# EAGLE schematic SterownikCNC4 (EAGLE 7.5.0)
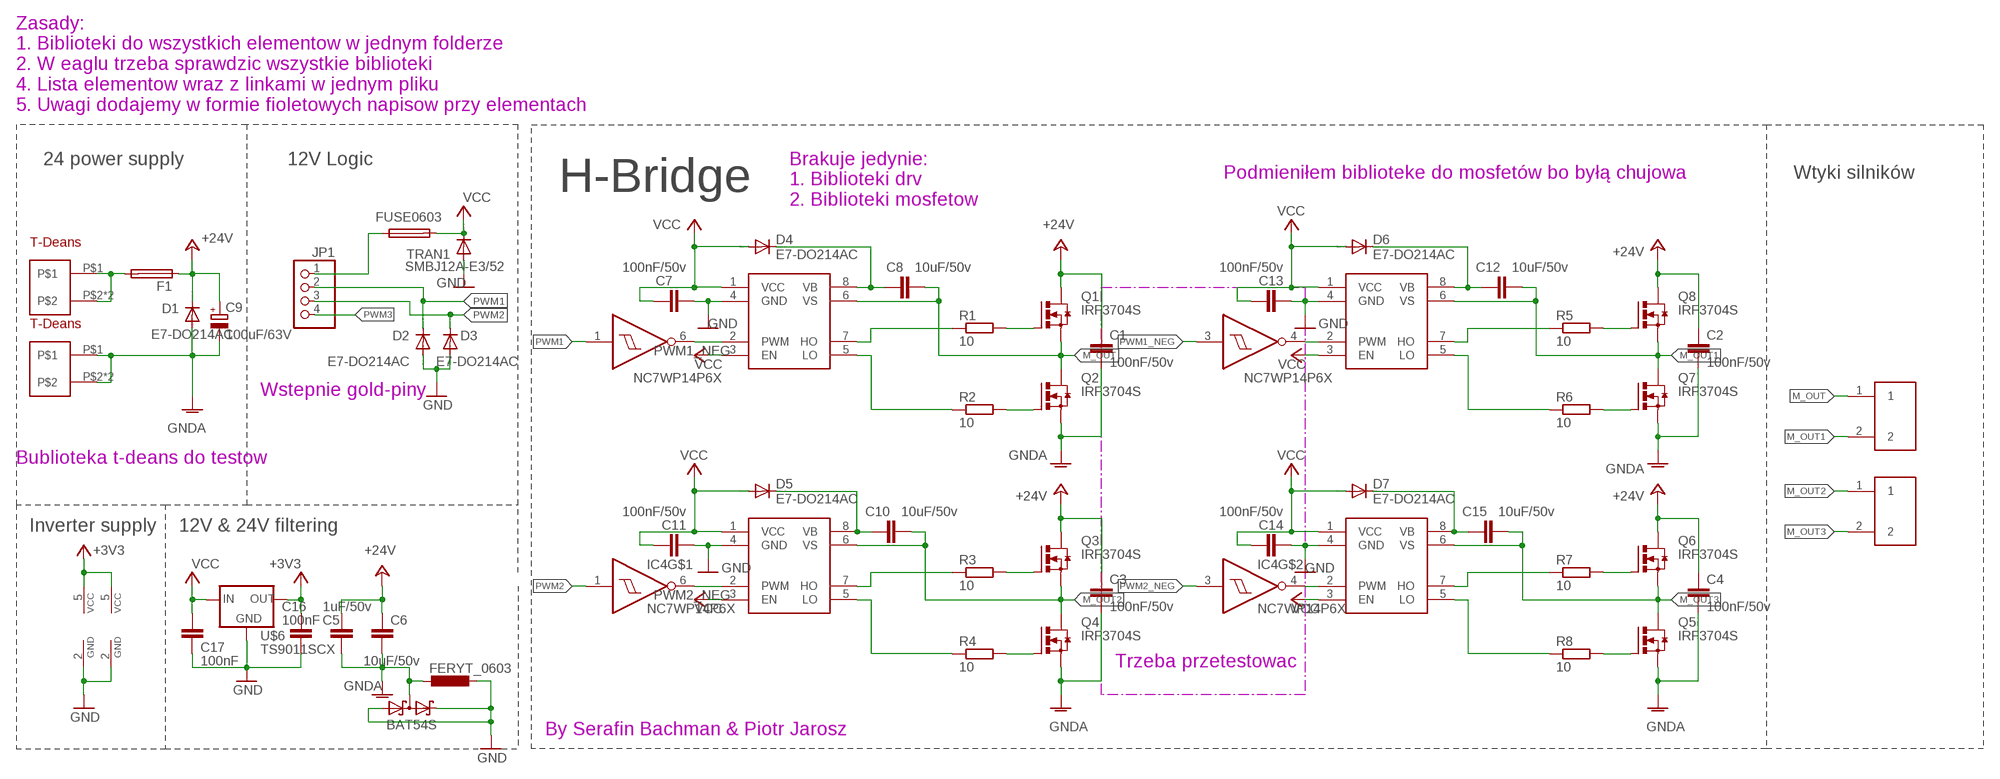
[diagram p0: schematic, sheet 1]

## Parts
C1  100nF/50v  C-EUC0603K  [C0603K]
C2  100nF/50v  C-EUC0603K  [C0603K]
C3  100nF/50v  C-EUC0603K  [C0603K]
C4  100nF/50v  C-EUC0603K  [C0603K]
C5  1uF/50v  C-EUC0603K  [C0603K]
C6  10uF/50v  C-EUC0603K  [C0603K]
C7  100nF/50v  C-EUC0603K  [C0603K]
C8  10uF/50v  C-EUC0603K  [C0603K]
C9  100uF/63V  CPOL-EUE5-10.5  [E5-10,5]
C10  10uF/50v  C-EUC0603K  [C0603K]
C11  100nF/50v  C-EUC0603K  [C0603K]
C12  10uF/50v  C-EUC0603K  [C0603K]
C13  100nF/50v  C-EUC0603K  [C0603K]
C14  100nF/50v  C-EUC0603K  [C0603K]
C15  10uF/50v  C-EUC0603K  [C0603K]
C16  100nF  C-EUC0603K  [C0603K]
C17  100nF  C-EUC0603K  [C0603K]
D1  E7-DO214AC  [DO214AC]
D2  E7-DO214AC  [DO214AC]
D3  E7-DO214AC  [DO214AC]
D4  E7-DO214AC  [DO214AC]
D5  E7-DO214AC  [DO214AC]
D6  E7-DO214AC  [DO214AC]
D7  E7-DO214AC  [DO214AC]
D8  BAT54S  [SOT23]
F1  TE5  [TE5]
IC1  NC7WP14P6X  [SOT65P210X110-6AN_SC88_SC70-6]
IC4  NC7WP14P6X  [SOT65P210X110-6AN_SC88_SC70-6]
JP1  PINHD-1X4  [1X04]
Q1  IRF3704S  [D2PACK]
Q2  IRF3704S  [D2PACK]
Q3  IRF3704S  [D2PACK]
Q4  IRF3704S  [D2PACK]
Q5  IRF3704S  [D2PACK]
Q6  IRF3704S  [D2PACK]
Q7  IRF3704S  [D2PACK]
Q8  IRF3704S  [D2PACK]
R1  10  R-EU_R0603  [R0603]
R2  10  R-EU_R0603  [R0603]
R3  10  R-EU_R0603  [R0603]
R4  10  R-EU_R0603  [R0603]
R5  10  R-EU_R0603  [R0603]
R6  10  R-EU_R0603  [R0603]
R7  10  R-EU_R0603  [R0603]
R8  10  R-EU_R0603  [R0603]
TRAN1  SMBJ12A-E3/52  [DO214AA]
U1  IR2104  [SO08]
U2  IR2104  [SO08]
U3  IR2104  [SO08]
U4  IR2104  [SO08]
U$2  T-DEANS  [T-DEANS]
U$3  FUSE0603  [0603]
U$4  FERYT_0603  [R0603]
U$5  T-DEANS  [T-DEANS]
U$6  TS9011SCX  [SOT23]
U$7  PTB-02_5.08MM  [PTB-5.08MM-02]
U$9  PTB-02_5.08MM  [PTB-5.08MM-02]

## Nets
+3V3: C16.1 IC1.5(VCC) IC4.5(VCC) U$6.2(OUT)
+12V: C7.1 C11.1 C13.1 C14.1 D4.A D5.A D6.A D7.A U1.1(VCC) U2.1(VCC) U3.1(VCC) U4.1(VCC) ; supply symbol labelled VCC
+24V: C1.1 C2.1 C3.1 C4.1 C5.1 C6.1 C9.+ D1.C F1.1 Q1.2(D) Q3.2(D) Q6.2(D) Q8.2(D)
F2: JP1.1 U$3.1
GND: C7.2 C11.2 C13.2 C14.2 C16.2 C17.2 D2.A D3.A D8.1(A1) D8.2(C2) IC1.2(GND) IC4.2(GND) TRAN1.A U1.4(GND) U2.4(GND) U3.4(GND) U4.4(GND) U$4.2 U$6.1(GND)
GNDA: C1.2 C2.2 C3.2 C4.2 C5.2 C6.2 C9.- D1.A D8.3(C1A2) Q2.3(S) Q4.3(S) Q5.3(S) Q7.3(S) U$4.1 U$5.P$1 U$5.P$2 U$5.P$3
M_OUT: C8.2 Q1.3(S) Q2.2(D) U1.6(VS) U$7.1
M_OUT1: C12.2 Q7.2(D) Q8.3(S) U2.6(VS) U$7.2
M_OUT2: C10.2 Q3.3(S) Q4.2(D) U3.6(VS) U$9.1
M_OUT3: C15.2 Q5.2(D) Q6.3(S) U4.6(VS) U$9.2
N$1: Q1.1(G) R1.2
N$2: Q2.1(G) R2.2
N$3: R1.1 U1.7(HO)
N$4: R2.1 U1.5(LO)
N$5: IC1.4(O) U2.2(PWM)
N$6: IC4.4(O) U4.2(PWM)
N$7: R5.1 U2.7(HO)
N$8: R6.1 U2.5(LO)
N$10: Q7.1(G) R6.2
N$11: Q8.1(G) R5.2
N$12: C10.1 D5.C U3.8(VB)
N$13: F1.2 U$2.P$1 U$2.P$2 U$2.P$3
N$14: R3.1 U3.7(HO)
N$15: R4.1 U3.5(LO)
N$16: Q4.1(G) R4.2
N$17: Q3.1(G) R3.2
N$18: C15.1 D7.C U4.8(VB)
N$20: R7.1 U4.7(HO)
N$21: R8.1 U4.5(LO)
N$22: Q5.1(G) R8.2
N$23: Q6.1(G) R7.2
N$49: C8.1 D4.C U1.8(VB)
N$51: C12.1 D6.C U2.8(VB)
PWM1: D2.C IC1.1(I) JP1.2
PWM1_NEG: IC1.3(I) IC1.6(O) U1.2(PWM)
PWM2: D3.C IC4.1(I) JP1.3
PWM2_NEG: IC4.3(I) IC4.6(O) U3.2(PWM)
PWM3: JP1.4
VCC: C17.1 TRAN1.C U1.3(EN) U2.3(EN) U3.3(EN) U4.3(EN) U$3.2 U$6.3(IN)

## Notes on the sheet
- Zasady:
  1. Biblioteki do wszystkich elementow w jednym folderze
  2. W eaglu trzeba sprawdzic wszystkie biblioteki 
  4. Lista elementow wraz z linkami w jednym pliku
  5. Uwagi dodajemy w formie fioletowych napisow przy elementach
- 24 power supply | 12V Logic
- Podmieniłem biblioteke do mosfetów bo byłą chujowa | Wtyki silników
- H-Bridge
- Brakuje jedynie:
  1. Biblioteki drv
  2. Biblioteki mosfetow
- Wstepnie gold-piny
- Bublioteka t-deans do testow
- Inverter supply | 12V & 24V filtering
- Trzeba przetestowac
- By Serafin Bachman & Piotr Jarosz

## Library data of the parts
C1-C8 C10-C17 = rcl:C-EU: CAPACITOR, European symbol
C9 = rcl:CPOL-EU: POLARIZED CAPACITOR, European symbol
D1-D7 = diode:E7-DO214AC
D8 = diode:BAT54S: Schottky Diodes Pin connection corrected 2011-05-04 Source: Fairchild .. BAT54.pdf
F1 = fuse:TE5: FUSE Wickmann; OC_FARNELL: unknown; OC_NEWARK: unknown
IC1 IC4 = bufory,invertery:NC7W*14
JP1 = pinhead:PINHD-1X4: PIN HEADER
Q1-Q8 = transistor-power:IRF3704: SMPS MOSFET HEXFET® Power MOSFET Source: http://www.irf.com/product-info/datasheets/data/irf3704.pdf
R1-R8 = rcl:R-EU_: RESISTOR, European symbol
TRAN1 = diode:SMBJ12A-E3/52
U1-U4 = robione:IR2104
U$2 U$5 = Conector_T-deans:T-DEANS
U$3 = fuse:FUSE0603
U$4 = rcl:FERYT_0603
U$6 = v-reg:TS9011SCX
U$7 U$9 = robione:PTB-02